# EAGLE design test_board (EAGLE 5.11)
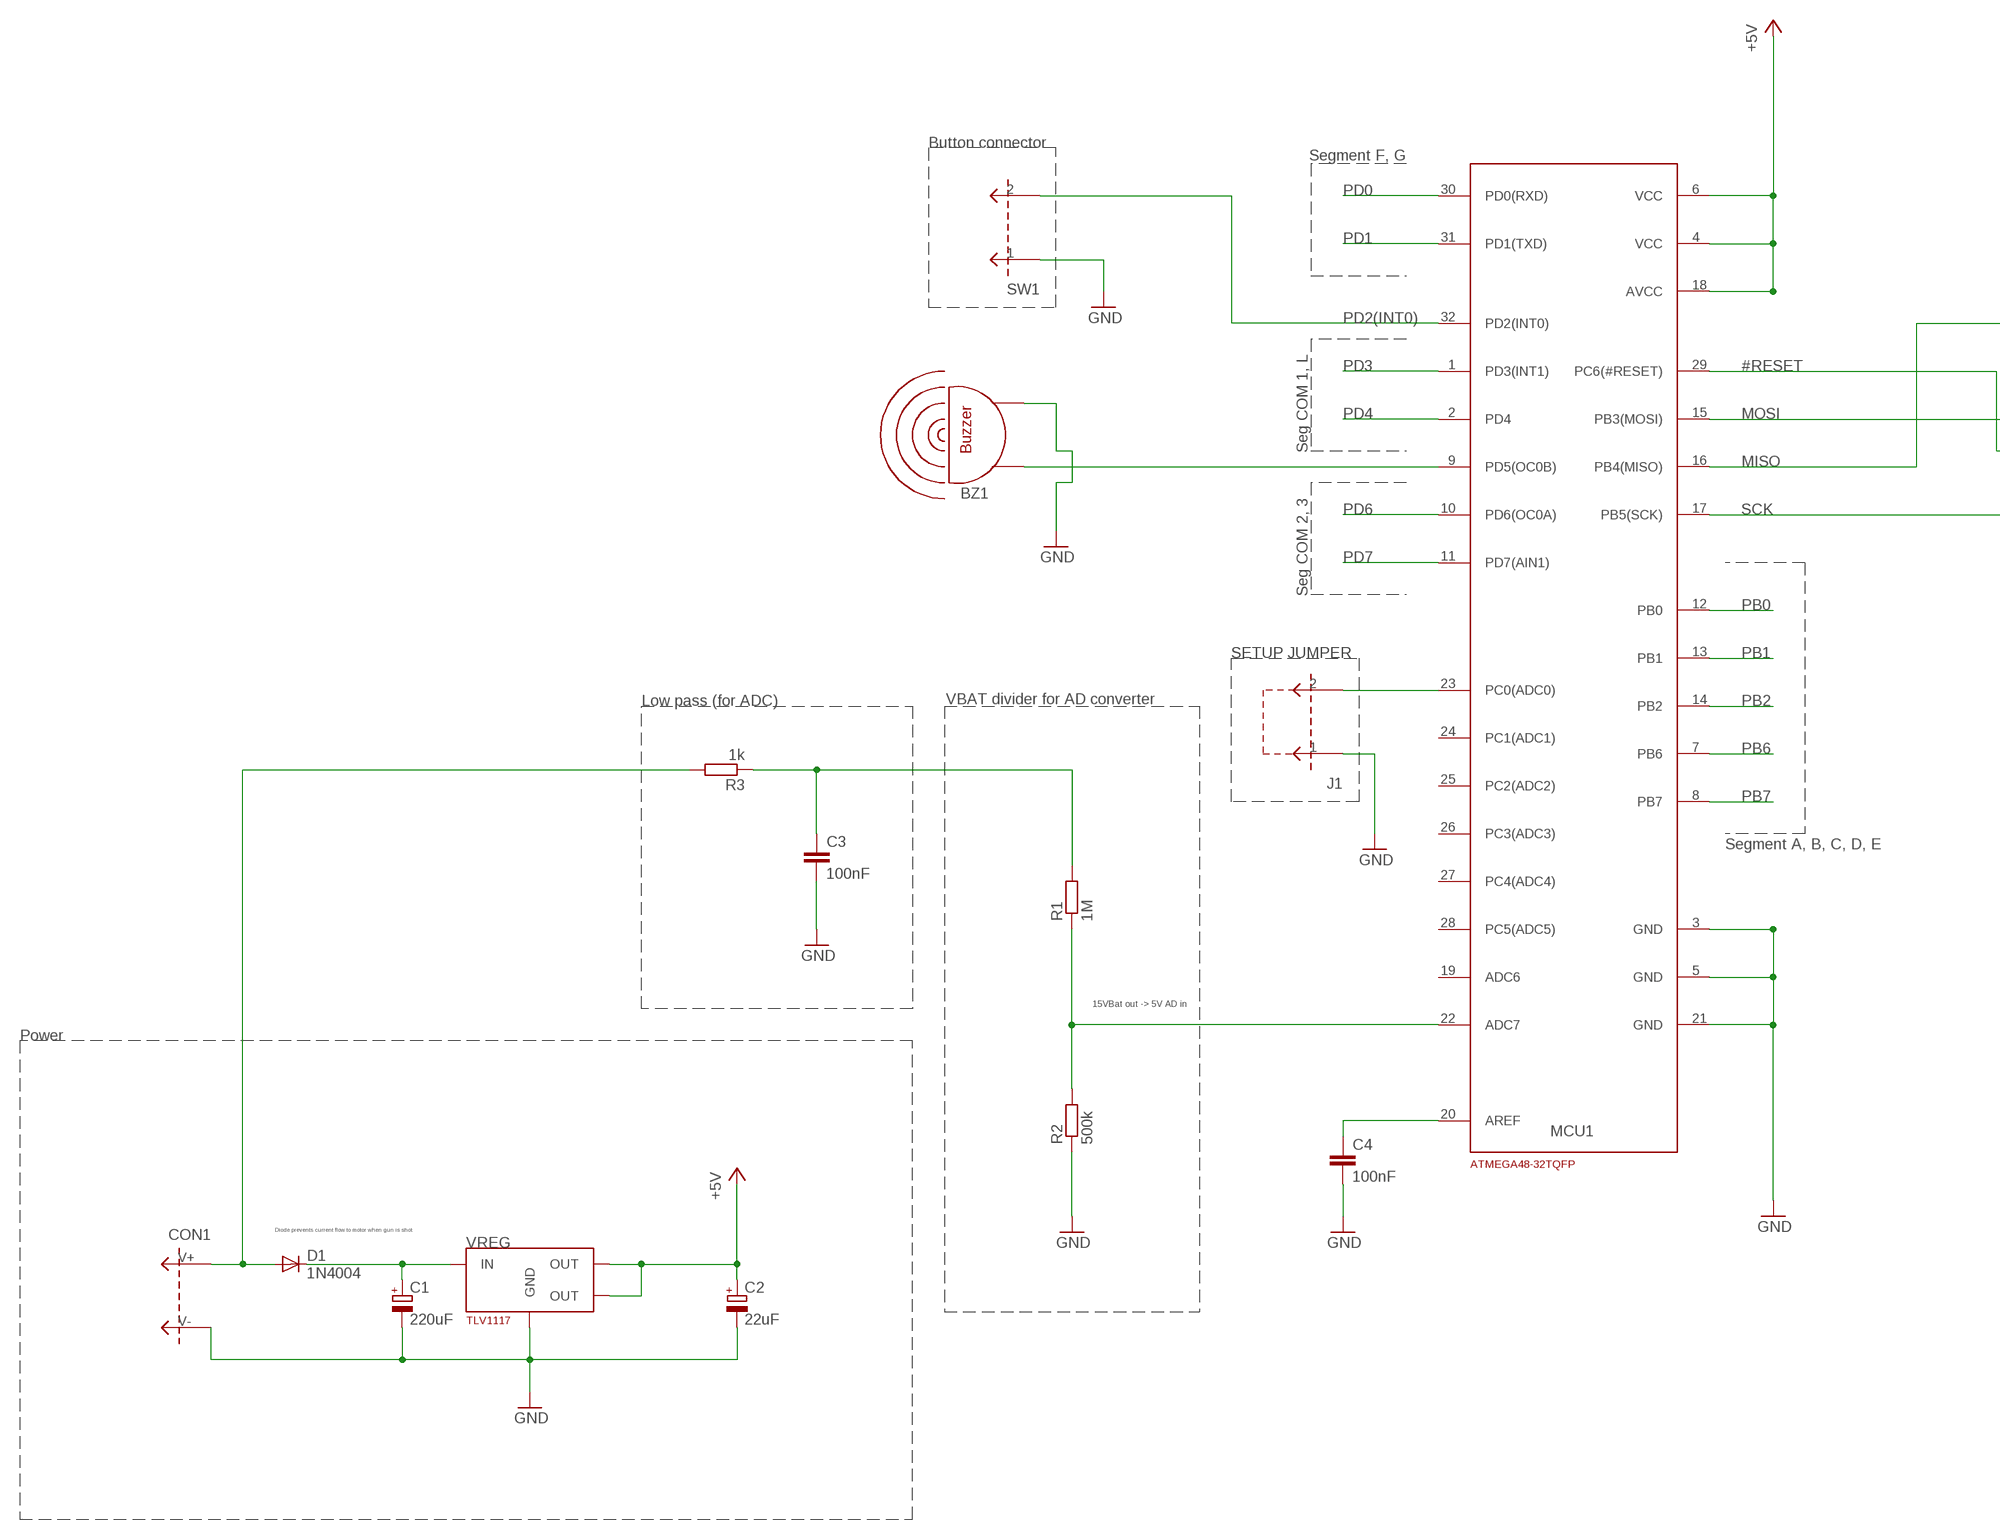
[diagram p0: schematic, sheet 1, part 1 of 2]
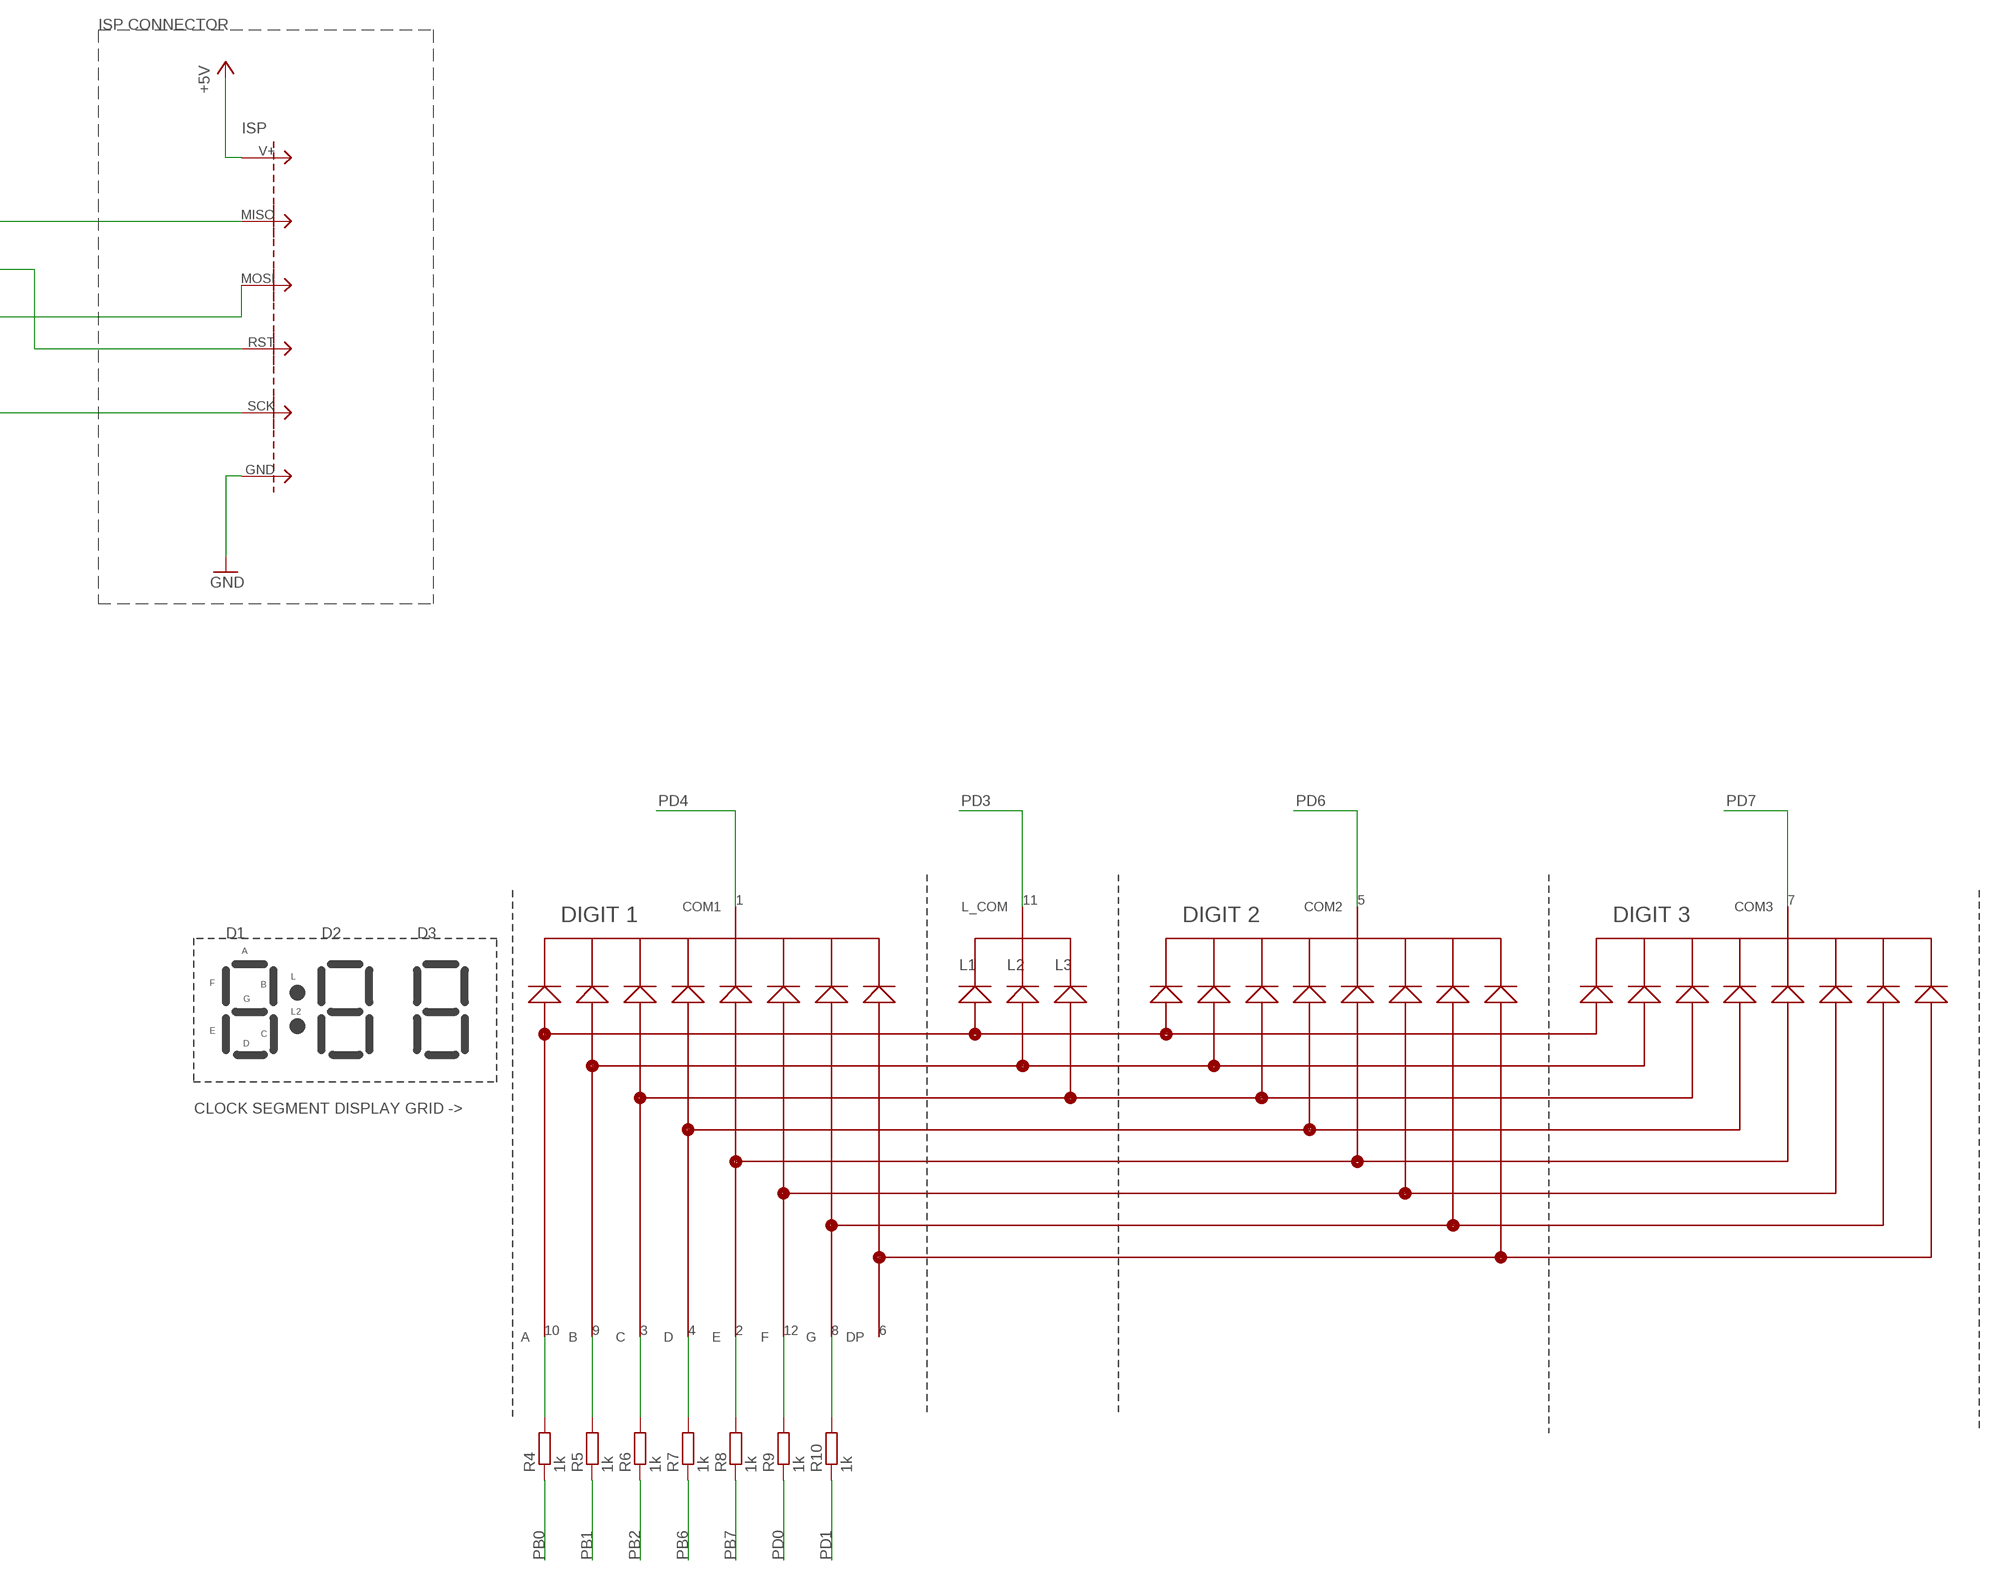
[diagram p1: schematic, sheet 1, part 2 of 2]

## Parts
BZ1  PS1720P02_BUZZER  [PS1720P02_BUZZER]
C1  220uF  CPOL-EUE3.5-8  [E3,5-8]
C2  22uF  CPOL-EUE1.5-5  [E1.5-5]
C3  100nF  C-EU075-032X103  [C075-032X103]
C4  100nF  C-EU075-032X103  [C075-032X103]
CON1  CONNECTOR_2PIN1X2_POWER_WIRE  [1X2_POWER_WIRE]
D1  1N4004  [DO41-10]
ISP  CONNECTOR_6PIN2X3_ISP  [2X3_ISP]
J1  CONNECTOR_2PIN1X2  [1X2_GENERIC]
MCU1  ATMEGA48-20PU-32TQFP  ATMEGA48-20PU-32TQFPTQFP32_HOME_ETCH  [TQFP32-08-HOMEETCH]
R1  1M  R-EU_0207/10  [0207/10]
R2  500k  R-EU_0207/10  [0207/10]
R3  1k  R-EU_0207/10  [0207/10]
R4  1k  R-EU_0207/10  [0207/10]
R5  1k  R-EU_0207/10  [0207/10]
R6  1k  R-EU_0207/10  [0207/10]
R7  1k  R-EU_0207/10  [0207/10]
R8  1k  R-EU_0207/10  [0207/10]
R9  1k  R-EU_0207/10  [0207/10]
R10  1k  R-EU_0207/10  [0207/10]
SEGMENT1  SEGMENT_CLOCK_MODULE_3_DIGIT_COMMON_CATHODE  [SEGMENT_CLOCK_DISPLAY_HDSP_433G]
SW1  CONNECTOR_2PIN1X2  [1X2_GENERIC]
VREG  5VREG_TLV1117  [SOT223]

## Nets
#RESET: ISP.RST MCU1.29(PC6(#RESET))
+5V: C2.+ ISP.V+ MCU1.4(VCC) MCU1.6(VCC) MCU1.18(AVCC) VREG.2(OUT) VREG.4(OUT)
GND: BZ1.P$2 C1.- C2.- C3.2 C4.2 CON1.V- ISP.GND J1.1 MCU1.3(GND) MCU1.5(GND) MCU1.21(GND) R2.1 SW1.1 VREG.1(GND)
MISO: ISP.MISO MCU1.16(PB4(MISO))
MOSI: ISP.MOSI MCU1.15(PB3(MOSI))
N$1: C1.+ D1.C VREG.3(IN)
N$2: C4.1 MCU1.20(AREF)
N$3: J1.2 MCU1.23(PC0(ADC0))
N$5: MCU1.22(ADC7) R1.1 R2.2
N$6: C3.1 R1.2 R3.1
N$7: R4.2 SEGMENT1.10(A)
N$8: R5.2 SEGMENT1.9(B)
N$9: R6.2 SEGMENT1.3(C)
N$10: R7.2 SEGMENT1.4(D)
N$11: R8.2 SEGMENT1.2(E)
N$12: R9.2 SEGMENT1.12(F)
N$13: R10.2 SEGMENT1.8(G)
N$16: BZ1.P$1 MCU1.9(PD5(OC0B))
PB0: MCU1.12(PB0) R4.1
PB1: MCU1.13(PB1) R5.1
PB2: MCU1.14(PB2) R6.1
PB6: MCU1.7(PB6) R7.1
PB7: MCU1.8(PB7) R8.1
PD0: MCU1.30(PD0(RXD)) R9.1
PD1: MCU1.31(PD1(TXD)) R10.1
PD2(INT0): MCU1.32(PD2(INT0)) SW1.2
PD3: MCU1.1(PD3(INT1)) SEGMENT1.11(L_COM)
PD4: MCU1.2(PD4) SEGMENT1.1(COM1)
PD6: MCU1.10(PD6(OC0A)) SEGMENT1.5(COM2)
PD7: MCU1.11(PD7(AIN1)) SEGMENT1.7(COM3)
SCK: ISP.SCK MCU1.17(PB5(SCK))
V_GUNBATTERY: CON1.V+ D1.A R3.2
Unconnected: MCU1.19(ADC6) MCU1.24(PC1(ADC1)) MCU1.25(PC2(ADC2)) MCU1.26(PC3(ADC3)) MCU1.27(PC4(ADC4)) MCU1.28(PC5(ADC5)) SEGMENT1.6(DP)

## Notes on the sheet
- ISP CONNECTOR
- Button connector
- Segment F, G
- Seg COM 1, L
- Seg COM 2, 3
- SETUP JUMPER
- Low pass (for ADC) | VBAT divider for AD converter
- Segment A, B, C, D, E
- 15VBat out -> 5V AD in
- Power
- Diode prevents current flow to motor when gun is shot.

## Library data of the parts
BZ1 = project_specific_parts:PS1720P02_BUZZER
C1 C2 = RCL:CPOL-EU: POLARIZED CAPACITOR, European symbol
C3 C4 = RCL:C-EU: CAPACITOR, European symbol
CON1 J1 SW1 = connectors:CONNECTOR_2PIN
D1 = project_specific_parts:1N4004: DIODE general purpose rectifier, 1 A
ISP = connectors:CONNECTOR_6PIN
MCU1 = project_specific_parts:ATMEGA48-20PU-32TQFP
R1-R10 = RCL:R-EU_: RESISTOR, European symbol
SEGMENT1 = project_specific_parts:SEGMENT_CLOCK_MODULE_3_DIGIT_COMMON_CATHODE
VREG = project_specific_parts:5VREG_TLV1117

## Board
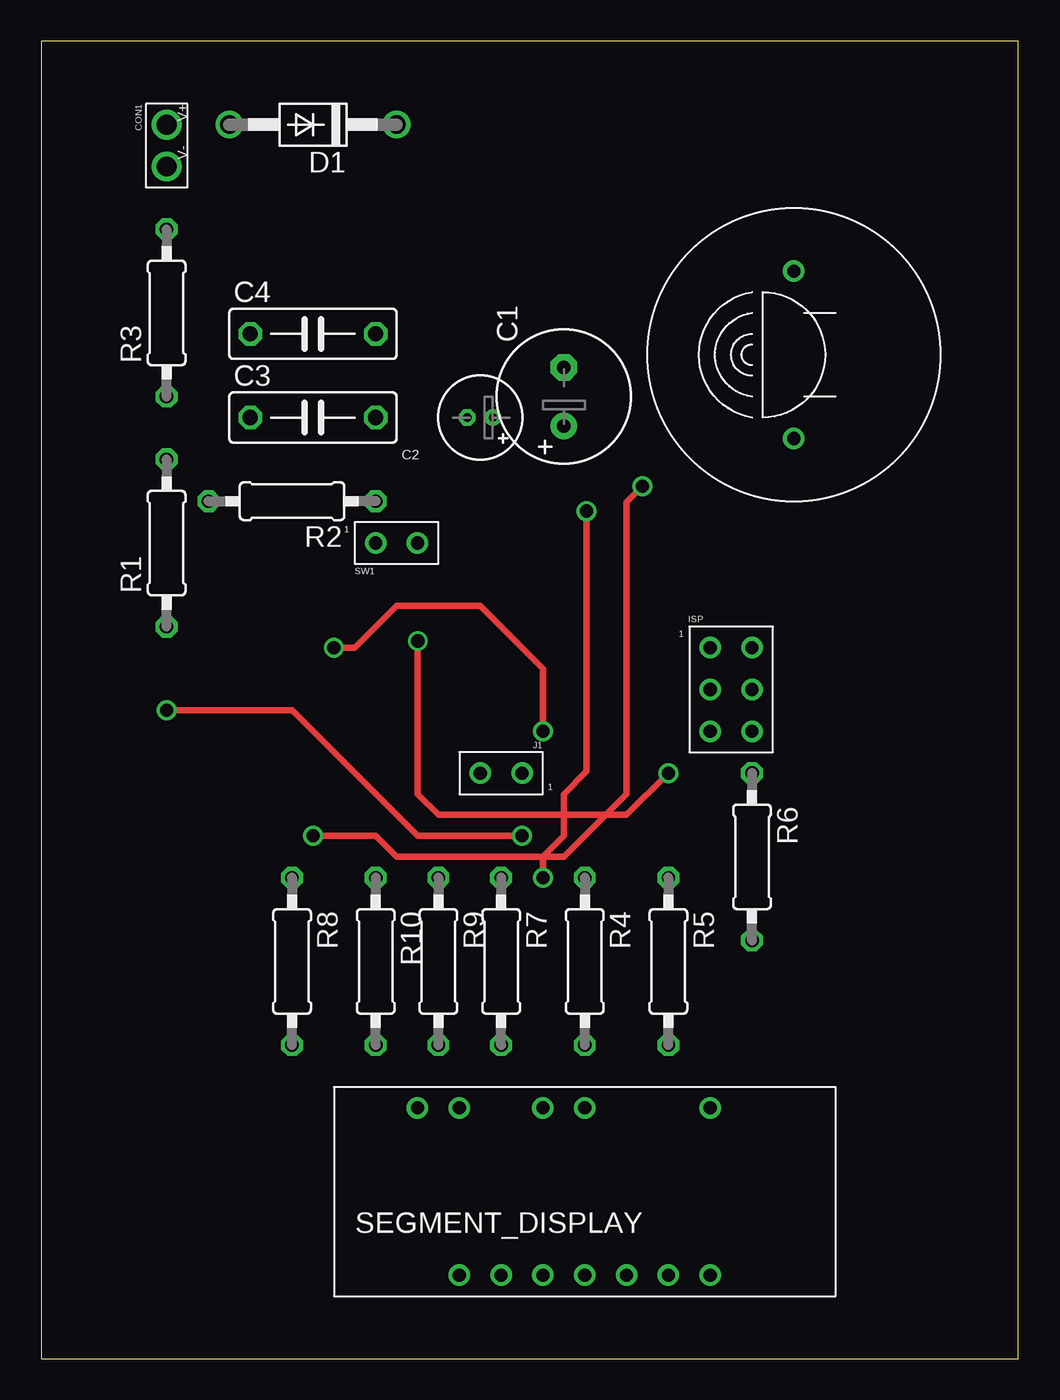
[diagram p2: board, top side]
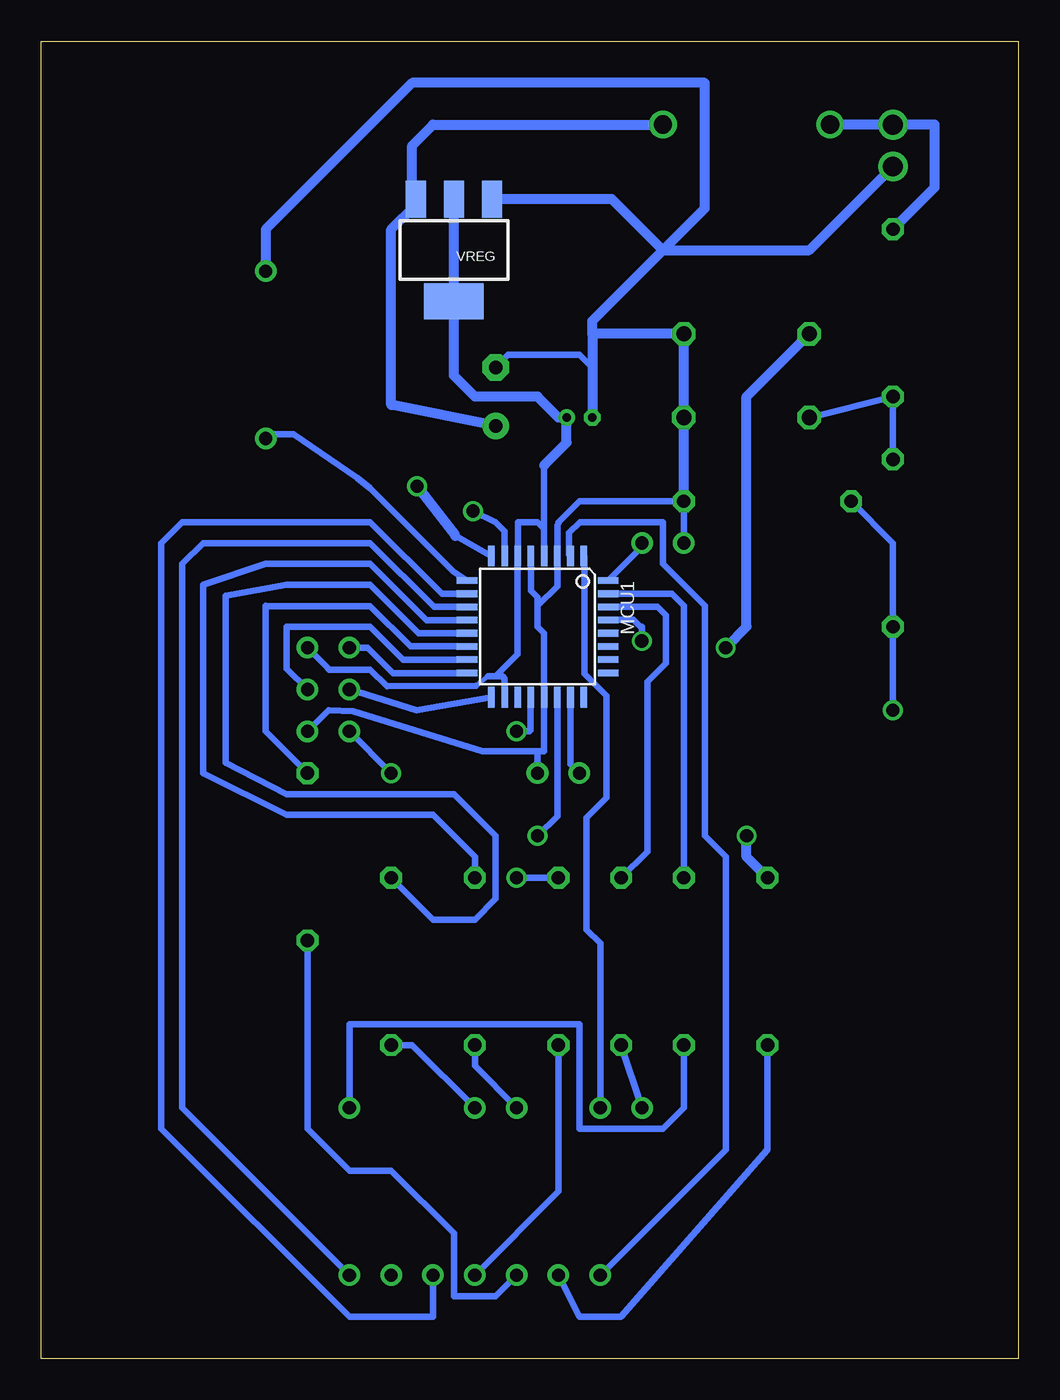
[diagram p3: board, bottom side, seen from below]

Size 59.36 x 80 mm. Coordinates in mm from the lower left corner, seen from the top.
Outline: 0,0 59.36,0 59.36,80 0,80 0,0
Copper layers (1*16): Top 0.035mm / dielectric 1.5mm / Bottom 0.035mm
Design rules: minimum track width 10mil, minimum drill 24mil, track to track 8mil, track to pad 8mil, pad to pad 8mil, via to via 8mil, smd to smd 8mil, copper to edge 40mil, drill to drill 8mil, minimum pad ring 10mil, minimum via ring 8mil, stop-mask expansion 4mil, vias tented up to drill 0mil, thermal gap 10mil

### Footprints (pad centres in the part's own frame; a part is rotated, then mirrored left to right if it is on the bottom)
PS1720P02_BUZZER = drill 0.8: P$1 -5.08,0; P$2 5.08,0
E3,5-8 = drill 0.813 pad 1.6: + -1.778,0 | drill 0.813 pad 1.6 octagon: - 1.778,0
E1.5-5 = drill 0.5: + -0.77,0 | drill 0.5 octagon: - 0.79,0
C075-032X103 = drill 0.914 octagon: 1 -3.81,0; 2 3.81,0
1X2_POWER_WIRE = drill 1.2: V+ -1.27,0; V- 1.27,0
DO41-10 = drill 1.118: A 5.08,0; C -5.08,0
2X3_ISP = drill 0.8: GND 1.27,-5.08; MISO -1.27,0; MOSI 1.27,-2.54; RST -1.27,-5.08; SCK -1.27,-2.54; V+ 1.27,0
1X2_GENERIC = drill 0.8: 1 0,0; 2 2.54,0
TQFP32-08-HOMEETCH = smd 1.27 x 0.4: 1 -4.293,2.8; 2 -4.293,2; 3 -4.293,1.2; 4 -4.293,0.4; 5 -4.293,-0.4; 6 -4.293,-1.2; 7 -4.293,-2; 8 -4.293,-2.8; 17 4.293,-2.8; 18 4.293,-2; 19 4.293,-1.2; 20 4.293,-0.4; 21 4.293,0.4; 22 4.293,1.2; 23 4.293,2; 24 4.293,2.8 | smd 0.4 x 1.27: 9 -2.8,-4.293; 10 -2,-4.293; 11 -1.2,-4.293; 12 -0.4,-4.293; 13 0.4,-4.293; 14 1.2,-4.293; 15 2,-4.293; 16 2.8,-4.293; 25 2.8,4.293; 26 2,4.293; 27 1.2,4.293; 28 0.4,4.293; 29 -0.4,4.293; 30 -1.2,4.293; 31 -2,4.293; 32 -2.8,4.293
0207/10 = drill 0.813 octagon: 1 -5.08,0; 2 5.08,0
SEGMENT_CLOCK_DISPLAY_HDSP_433G = drill 0.8: 1 0,-5.08; 2 2.54,-5.08; 3 5.08,-5.08; 4 7.62,-5.08; 5 10.16,-5.08; 6 12.7,-5.08; 7 15.24,-5.08; 8 15.24,5.08; 9 7.62,5.08; 10 5.08,5.08; 11 0,5.08; 12 -2.54,5.08
SOT223 = smd 1.219 x 2.235: 1 -2.311,-3.099; 2 0,-3.099; 3 2.311,-3.099 | smd 3.6 x 2.2: 4 0,3.099

### Placement (x,y rotation side)
BZ1  45.72,60.96 90 top
C1  31.75,58.42 90 top
C2  26.67,57.15 180 top
C3  16.51,57.15 0 top
C4  16.51,62.23 0 top
CON1  7.62,73.66 270 top
D1  16.51,74.93 180 top
ISP  41.91,43.18 0 top
J1  29.21,35.56 180 top
MCU1  29.21,44.45 270 bottom
R1  7.62,49.53 90 top
R2  15.24,52.07 180 top
R3  7.62,63.5 90 top
R4  33.02,24.13 270 top
R5  38.1,24.13 270 top
R6  43.18,30.48 270 top
R7  27.94,24.13 270 top
R8  15.24,24.13 270 top
R9  24.13,24.13 270 top
R10  20.32,24.13 270 top
SEGMENT1  25.4,10.16 0 top
SW1  20.32,49.53 0 top
VREG  34.29,67.31 180 bottom

### Tracks (layer width: path | path; a pad name or v marks a point on that pad's centre or on a via)
#RESET  (via drill 0.8)
  Top 0.406: v22.88,43.58 22.88,34.27 24.13,33.02 35.56,33.02 v38.1,35.56
  Bottom 0.406: v38.1,35.56 ISP.RST | v22.88,43.58 22.88,44.43 22.86,44.45 22.97,44.45 23.38,44.86 MCU1.29
+5V
  Bottom 0.305: 32.22,41.45 32.95,40.85
  Bottom 0.406: MCU1.18 31.21,41.3 31.35,41.45 31.75,41.45 | 31.75,41.45 32.22,41.45 | 32.95,40.85 38.36,40.84 39.37,41.84 41.87,41.84 41.92,41.9 41.92,41.92 ISP.V+ | 28.82,54.25 MCU1.4 28.81,50.4 29.21,50.8 30.39,50.8 30.39,48.81 MCU1.6 30.41,42.78 31.75,41.45
  Bottom 0.61: VREG.4 VREG.2 | VREG.4 34.29,64 | 28.82,54.25 27.44,55.63 C2.+ 27.94,57.15 29.21,58.42 33.02,58.42 34.29,59.69 VREG.4
GND
  Bottom 0.406: 29.21,45.72 29.21,44.45 28.81,44.05 MCU1.21 28.81,38.58 28.82,36.89 29.21,36.89 | 29.21,45.72 29.21,46.23 29.62,46.64 MCU1.5 | 29.21,45.72 28.01,46.92 MCU1.3 28,49.44 27.99,50.61 27.94,50.74 27.94,50.8 26.67,52.07 R2.1 SW1.1 | ISP.GND 41.91,39.37 40.4,39.33 32.55,36.89 29.21,36.89 | C2.- 25.88,60.17 26.67,60.96 30.99,60.96 C1.- | J1.1 29.21,36.89
  Bottom 0.61: 25.88,62.23 25.88,63.02 21.59,67.31 | 25.88,62.23 C2.- | 21.59,67.31 12.7,67.31 CON1.V- | VREG.1 24.69,70.41 21.59,67.31 | 25.88,62.23 C4.2 C3.2 R2.1 | BZ1.P$2 45.72,68.58 36.83,77.47 19.05,77.47 19.05,69.85 21.59,67.31
MISO
  Bottom 0.406: ISP.MISO 39.53,43.18 37.99,41.63 33.52,41.63 MCU1.16
MOSI
  Bottom 0.406: MCU1.15 37.37,42.45 39.37,44.45 44.45,44.45 44.45,41.91 ISP.MOSI
N$1
  Bottom 0.61: D1.C 35.56,74.93 36.83,73.66 36.83,70.64 VREG.3 36.6,70.08 38.1,68.58 38.1,57.91 C1.+
N$2  (via drill 0.8)
  Top 0.406: v17.78,43.18 19.05,43.18 21.59,45.72 26.67,45.72 30.48,41.91 v30.48,38.1
  Bottom 0.406: v30.48,38.1 29.71,38.1 29.63,38.18 29.63,40.13 MCU1.20
  Bottom 0.61: C4.1 16.51,58.42 16.51,44.45 v17.78,43.18
N$3
  Bottom 0.406: MCU1.23 27.21,36.1 J1.2
N$5  (via drill 0.8)
  Top 0.406: v7.62,39.37 15.24,39.37 22.86,31.75 v29.21,31.75
  Bottom 0.406: v7.62,39.37 R1.1 7.62,49.53 R2.2 | MCU1.22 28.01,32.95 v29.21,31.75
N$6
  Bottom 0.406: R1.2 R3.1 C3.1
N$7
  Bottom 0.406: R4.2 33.02,17.78 SEGMENT1.10
N$8
  Bottom 0.406: R5.2 36.83,19.05 SEGMENT1.9
N$9
  Bottom 0.406: R6.2 43.18,13.97 40.64,11.43 38.1,11.43 34.29,7.62 34.29,3.81 31.75,3.81 SEGMENT1.3
N$10
  Bottom 0.406: R7.2 27.94,10.16 SEGMENT1.4
N$11
  Bottom 0.406: R8.2 15.24,12.7 24.13,2.54 26.67,2.54 SEGMENT1.2
N$12
  Bottom 0.406: SEGMENT1.12 R9.2
N$13
  Bottom 0.406: R10.2 20.32,15.24 21.59,13.97 26.67,13.97 26.67,20.32 40.64,20.32 SEGMENT1.8
N$16
  Bottom 0.406: MCU1.9 34.35,47.81 39.39,52.85 40.16,53.48 44.04,56.14 45.46,56.14 BZ1.P$1
PB0
  Bottom 0.406: MCU1.12 35.96,44.85 39.37,48.26 45.72,48.26 49.53,46.99 49.53,35.56 44.45,33.02 35.56,33.02 33.02,30.48 R4.1
PB1
  Bottom 0.406: MCU1.13 36.43,44.05 39.37,46.99 44.45,46.99 48.14,46.34 48.14,36.18 44.45,34.29 34.29,34.29 31.75,31.75 31.75,27.94 33.02,26.67 35.56,26.67 R5.1
PB2
  Bottom 0.406: MCU1.14 36.93,43.25 39.37,45.7 45.7,45.7 45.72,45.72 45.72,38.1 R6.1
PB6  (via drill 0.8)
  Top 0.406: v33.13,51.47 33.13,35.67 31.75,34.29 31.75,31.75 30.48,30.48 v30.48,29.21
  Bottom 0.406: MCU1.7 31.21,50.26 31.75,50.8 v33.13,51.47 | R7.1 v30.48,29.21
PB7  (via drill 0.8)
  Top 0.406: v16.51,31.75 20.32,31.75 21.59,30.48 31.75,30.48 35.56,34.29 35.56,52.02 v36.52,52.98
  Bottom 0.406: 34.19,49.96 MCU1.8
  Bottom 0.61: v36.52,52.98 34.19,49.96 | v16.51,31.75 16.51,30.48 R8.1
PD0
  Bottom 0.406: MCU1.30 21.93,45.65 21.42,45.14 21.42,42.23 22.54,41.11 22.54,30.8 R9.1
PD1
  Bottom 0.406: R10.1 20.32,45.72 21.05,46.45 MCU1.31
PD2(INT0)
  Bottom 0.406: SW1.2 22.86,49.31 MCU1.32
PD3
  Bottom 0.406: SEGMENT1.11 25.4,25.22 26.23,26.05 26.23,32.85 25.02,34.06 25.02,40.24 26.37,41.6 26.37,48.7 MCU1.1
PD4
  Bottom 0.406: SEGMENT1.1 17.78,12.7 17.78,30.48 19.05,31.75 19.05,45.72 21.59,48.26 21.59,50.8 26.63,50.8 27.29,50.15 27.29,48.82 MCU1.2
PD6
  Bottom 0.406: MCU1.10 35.02,46.45 39.37,50.8 50.8,50.8 52.07,49.53 52.07,13.97 40.64,2.54 35.56,2.54 SEGMENT1.5
PD7
  Bottom 0.406: MCU1.11 35.49,45.65 39.37,49.53 49.53,49.53 50.8,48.26 50.8,15.24 SEGMENT1.7
SCK
  Bottom 0.406: MCU1.17 36.55,39.39 ISP.SCK
V_GUNBATTERY
  Bottom 0.61: R3.2 5.08,71.12 5.08,74.93 CON1.V+ D1.A